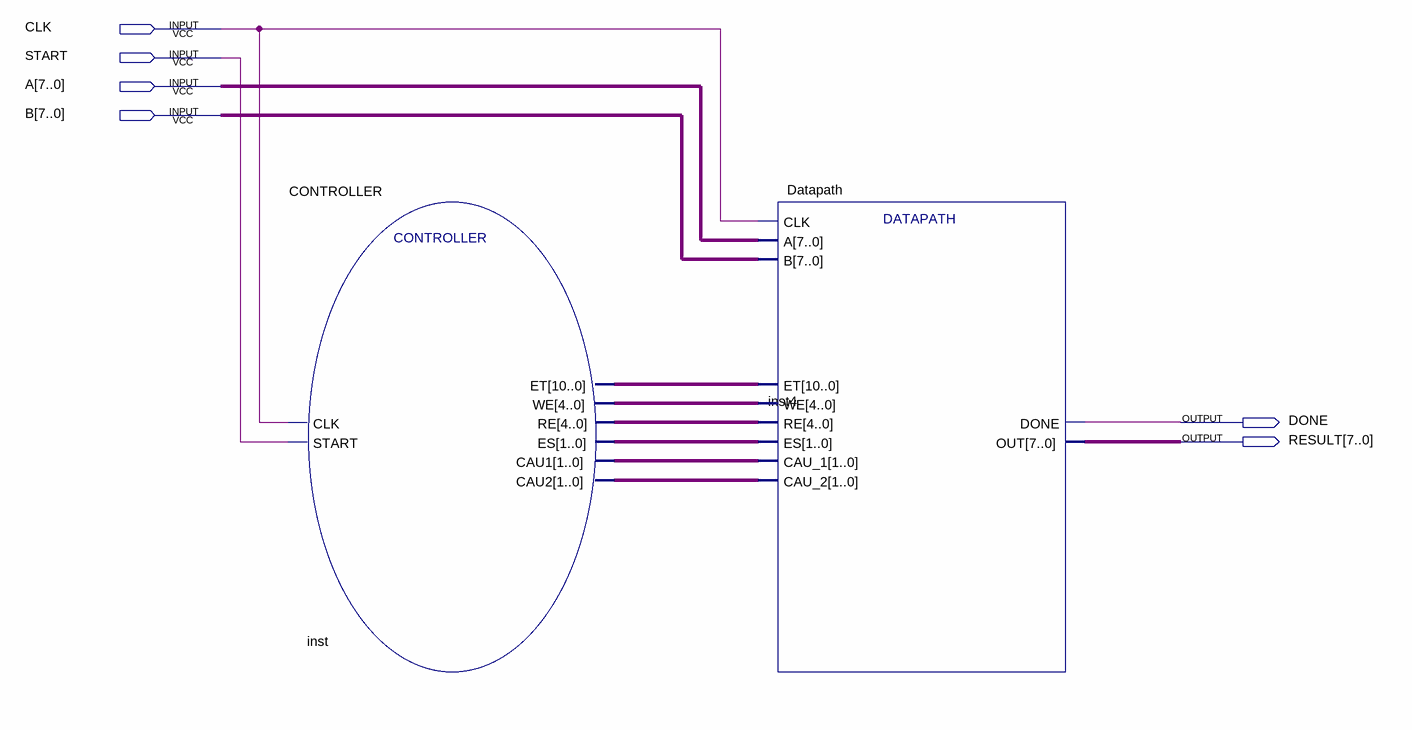
[diagram p0: schematic sheet]
// Quartus schematic Datapath_pipelining.bdf as structural Verilog: 2 symbols, 6 pins
module Datapath_pipelining (
  input  CLK,
  input  START,
  input  [7:0] A,
  input  [7:0] B,
  output DONE,
  output [7:0] RESULT
);

  wire [1:0] inst_cau1, inst_cau2, inst_es;
  wire [4:0] inst_re, inst_we;
  wire [10:0] inst_et;

  CONTROLLER inst (
    .START(START), .CLK(CLK), .ET(inst_et), .WE(inst_we), .RE(inst_re), .ES(inst_es), .CAU1(inst_cau1),
    .CAU2(inst_cau2));
  Datapath inst4 (
    .B(B), .CAU_2(inst_cau2), .CAU_1(inst_cau1), .ES(inst_es), .RE(inst_re), .WE(inst_we), .ET(inst_et),
    .CLK(CLK), .A(A), .DONE(DONE), .OUT(RESULT));
endmodule
